# EAGLE design ds1307 (EAGLE 6.6.0)
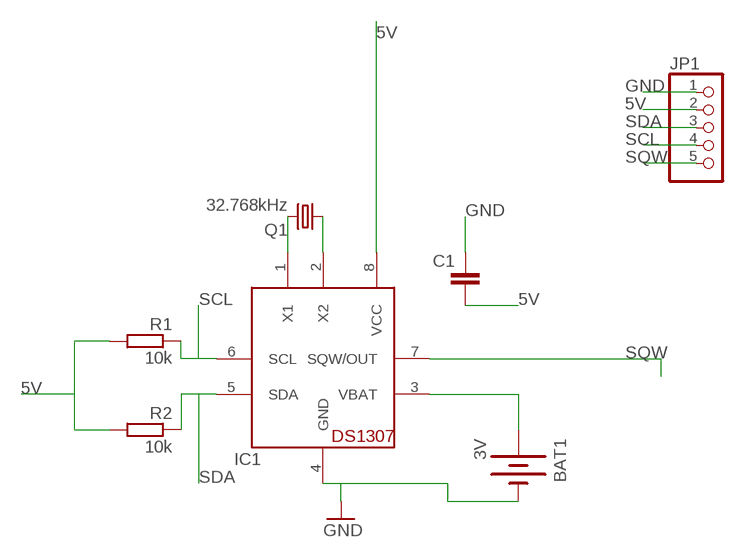
[diagram p0: schematic, sheet 1]

## Parts
BAT1  3V  BATTERY20PTH  [BATTCOM_20MM_PTH]
C1  C-EUC1206  [C1206]
IC1  DS1307  [DIL08]
JP1  PINHD-1X5  [1X05]
Q1  32.768kHz  CRYSTALTC38H  [TC38H]
R1  10k  R-EU_R1206  [R1206]
R2  10k  R-EU_R1206  [R1206]

## Nets
5V: C1.2 IC1.8(VCC) JP1.2 R1.2 R2.2
GND: BAT1.2(-) C1.1 IC1.4(GND) JP1.1
N$1: IC1.2(X2) Q1.1
N$2: IC1.1(X1) Q1.2
N$3: BAT1.1(+) IC1.3(VBAT)
SCL: IC1.6(SCL) JP1.4 R1.1
SDA: IC1.5(SDA) JP1.3 R2.1
SQW: IC1.7(SQW/OUT) JP1.5

## Library data of the parts
BAT1 = SparkFun-Electromechanical:BATTERY: Battery Holders Various common sizes : AA, AAA, 18650 (PRT-12895), 20mm coin cell and 12mm coin cell. 20MM_4LEGS, BATT-10373
C1 = rcl:C-EU: CAPACITOR, European symbol
IC1 = adafruit:DS1307: DS1307 Real time clock (RTC) with battery backup ability. Talk to it via i2c
JP1 = pinhead:PINHD-1X5: PIN HEADER
Q1 = SparkFun-FreqCtrl:CRYSTAL: Various standard crystals. Proven footprints.
R1 R2 = rcl:R-EU_: RESISTOR, European symbol

## Board
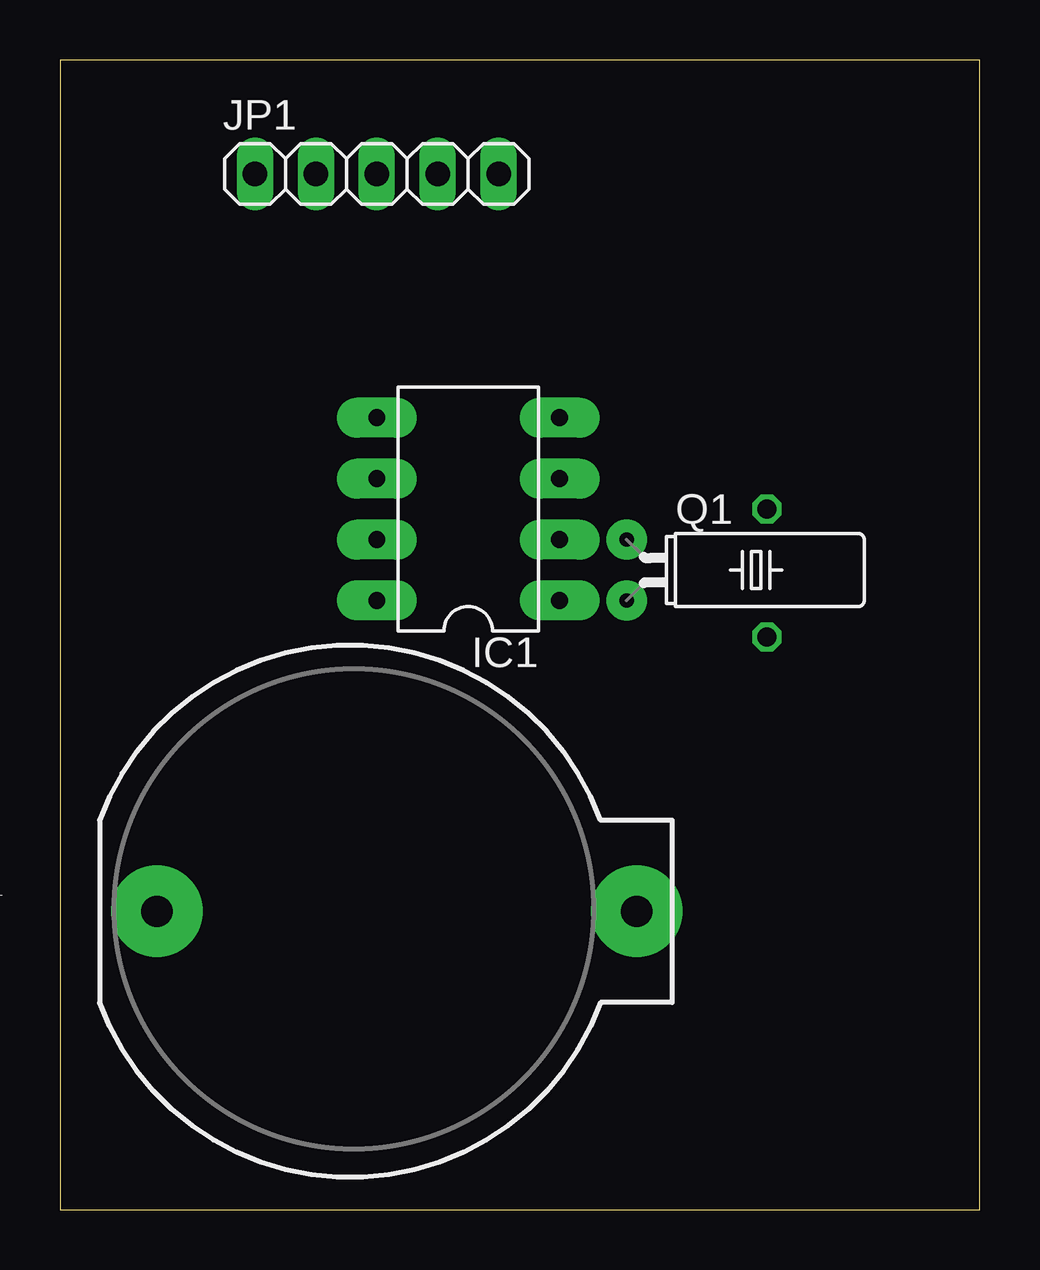
[diagram p1: board, top side]
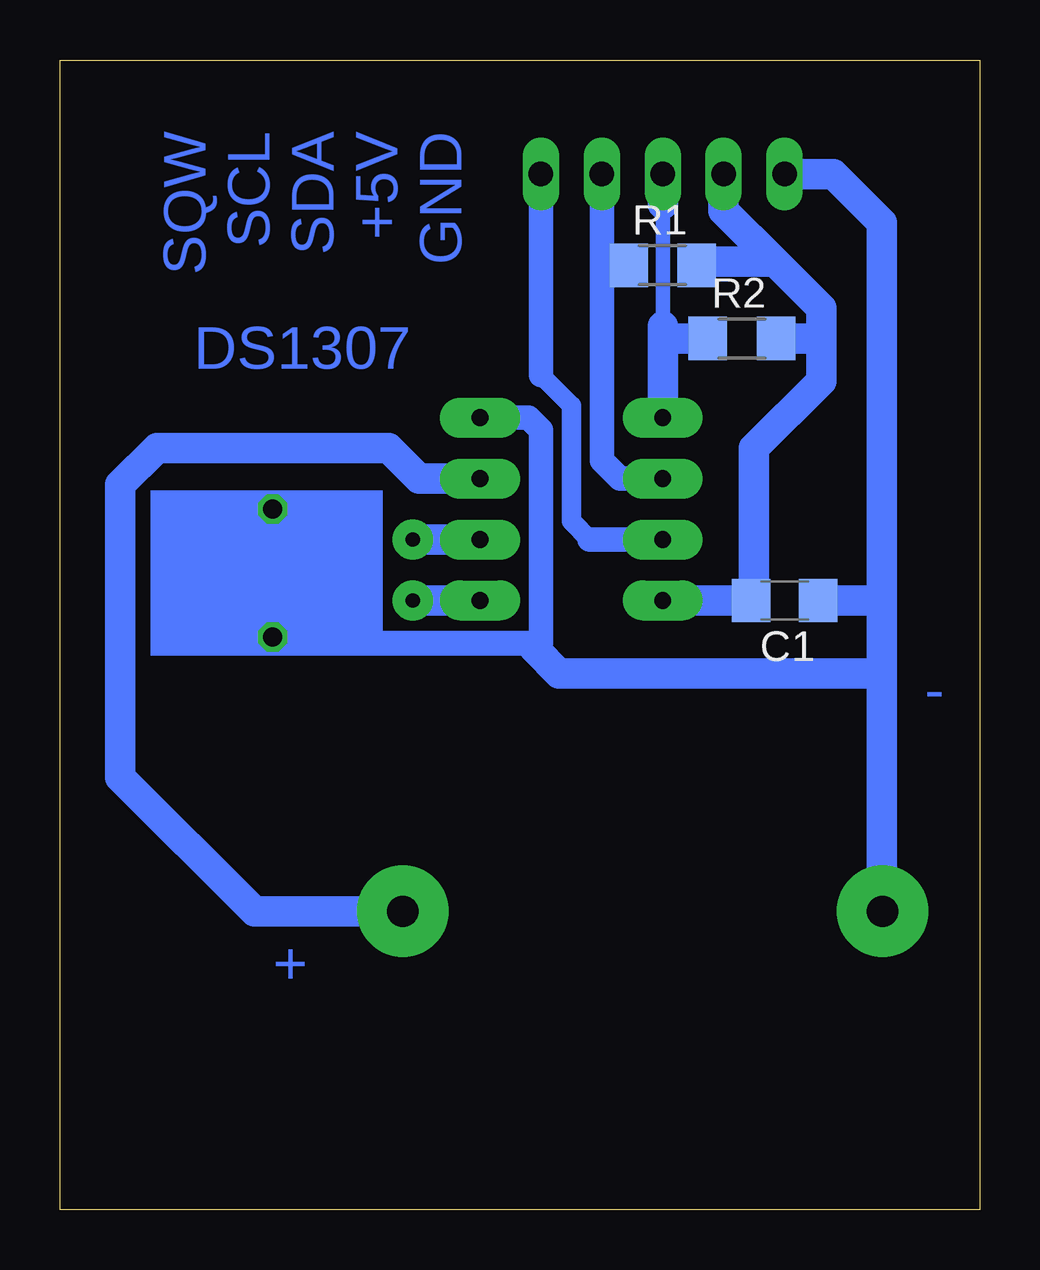
[diagram p2: board, bottom side, seen from below]

Size 38.33 x 47.93 mm. Coordinates in mm from the lower left corner, seen from the top.
Outline: 0,0 38.33,0 38.33,47.93 0,47.93 0,0
Copper layers (1*16): Top 0.035mm / dielectric 1.5mm / Bottom 0.035mm
Design rules "default": minimum track width 10mil, minimum drill 24mil, track to track 8mil, track to pad 8mil, pad to pad 8mil, via to via 8mil, smd to smd 8mil, copper to edge 40mil, drill to drill 8mil, minimum pad ring 10mil, minimum via ring 8mil, stop-mask expansion 4mil, vias tented up to drill 0mil, thermal gap 10mil

### Footprints (pad centres in the part's own frame; a part is rotated, then mirrored left to right if it is on the bottom)
BATTCOM_20MM_PTH = drill 1.3 pad 3.81: 1 11.85,0; 2 -8.15,0
C1206 = smd 1.6 x 1.8: 1 -1.4,0; 2 1.4,0
DIL08 = drill 0.7 pad 1.676 long: 1 -3.81,-3.81; 2 -1.27,-3.81; 3 1.27,-3.81; 4 3.81,-3.81; 5 3.81,3.81; 6 1.27,3.81; 7 -1.27,3.81; 8 -3.81,3.81
1X05 = drill 1.016 long: 1 -5.08,0; 2 -2.54,0; 3 0,0; 4 2.54,0; 5 5.08,0
TC38H = drill 0.6 pad 1.676: 1 -1.27,0; 2 1.27,0
R1206 = smd 1.6 x 1.803: 1 -1.422,0; 2 1.422,0

### Placement (x,y rotation side)
BAT1  12.19,12.45 0 top
C1  8.13,25.4 180 bottom
IC1  17.02,29.21 90 top
JP1  13.21,43.18 0 top
Q1  23.62,26.67 270 top
R1  13.21,39.37 0 bottom
R2  9.91,36.32 0 bottom

### Tracks (layer width: path | path; a pad name or v marks a point on that pad's centre or on a via)
5V
  Bottom 1.27: IC1.8 C1.2 9.4,25.53 9.4,31.75 6.6,34.54 6.6,36.07 | R1.2 11.79,39.52 8.53,39.52 | JP1.2 10.67,41.66 8.53,39.52 | 6.6,36.07 6.6,37.59 8.53,39.52 | R2.2 6.86,36.32 6.6,36.07
GND
  Bottom 1.016: IC1.4 18.8,33.02 18.29,32.51 18.29,23.62 18.54,23.37
  Bottom 1.27: 18.54,23.37 17.53,22.35 4.06,22.35 | JP1.1 6.1,43.18 4.06,41.15 4.06,25.15 | 4.06,25.15 4.06,22.35 | 4.06,22.35 4.06,12.45 BAT1.2 | C1.1 4.32,25.4 4.06,25.15
N$1
  Bottom 1.27: IC1.2 Q1.1
N$2
  Bottom 1.27: IC1.1 Q1.2
N$3
  Bottom 1.27: BAT1.1 30.23,12.45 35.81,18.03 35.81,30.23 34.29,31.75 24.64,31.75 23.37,30.48 IC1.3
N$4  (via drill 0.8)
  other vias: 29.46,23.88 29.46,29.21
SCL
  Bottom 1.016: IC1.6 14.99,30.48 15.75,31.24 15.75,39.37 | 15.75,39.37 JP1.4 | R1.1 15.75,39.37
SDA
  Bottom 0.61: 13.21,41.91 13.21,36.83
  Bottom 1.27: JP1.3 13.21,41.91 | 13.21,36.83 13.21,36.07 | 13.21,36.07 IC1.5 | R2.1 12.95,36.32 13.21,36.07
SQW
  Bottom 0.813: 18.29,34.8 17.02,33.53 17.02,28.7 16.26,27.94
  Bottom 1.016: JP1.5 18.29,34.8 | 16.26,27.94 IC1.7
(copper drawn outside any net)
  shapes: Bottom area x2

### Text on the board
Bottom: SQW / SCL / SDA / +5V / GND | DS1307 | - | +